# Altium schematic sheet 08_BB_Processor.SchDoc: BB Processor (part 3 of 3)
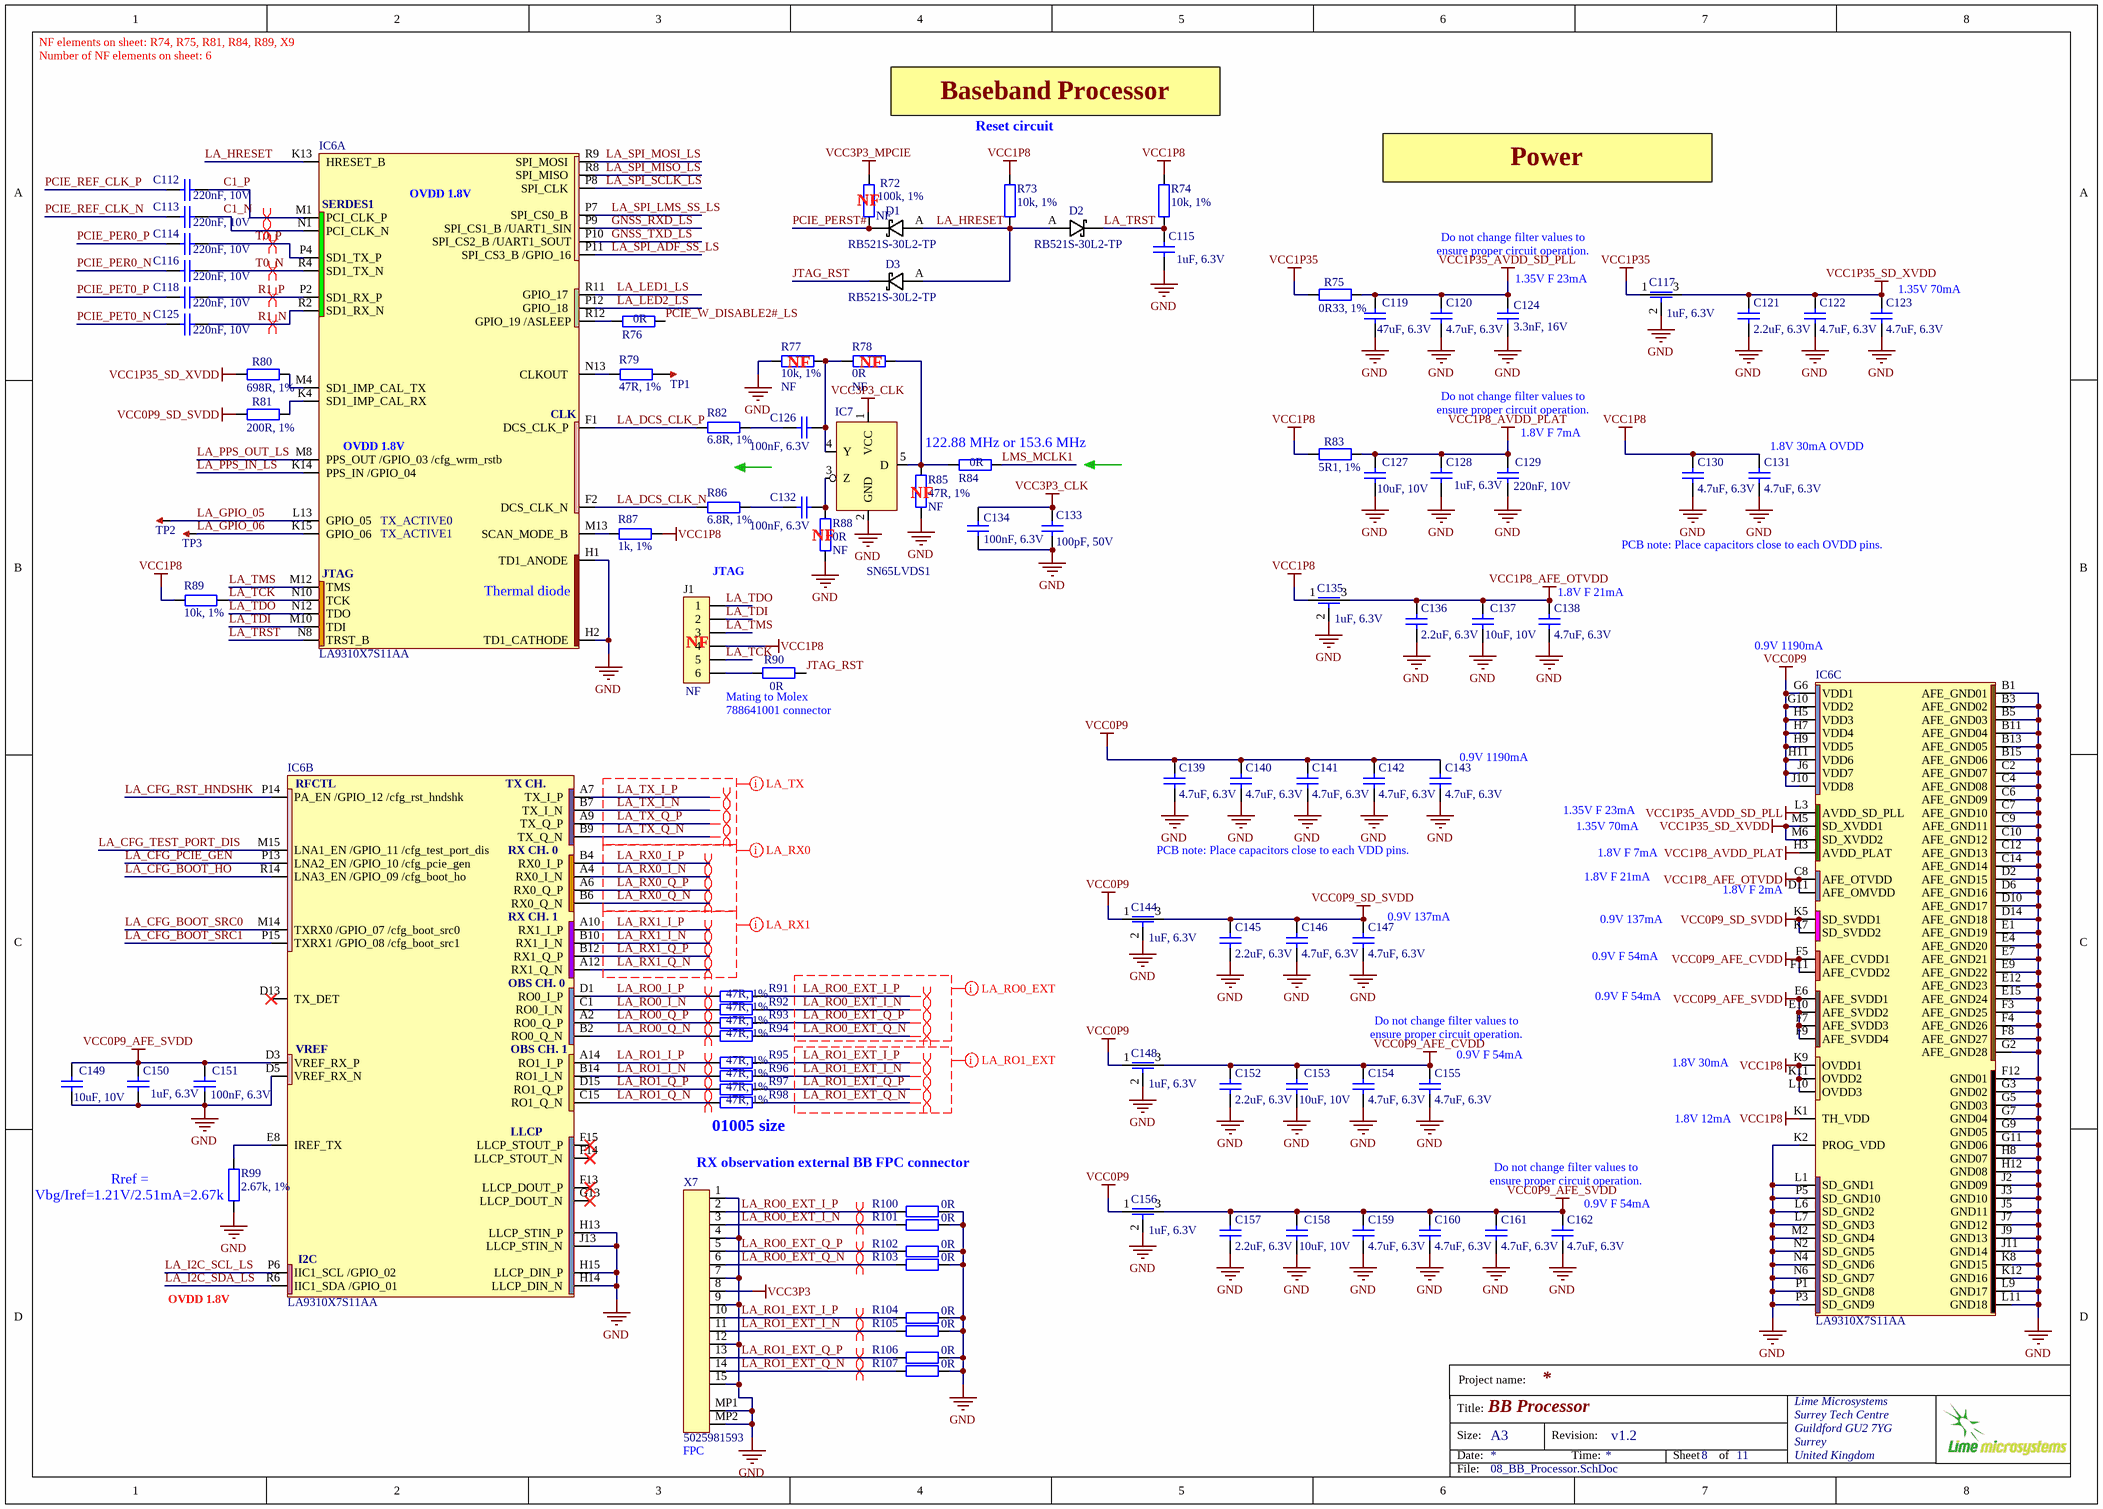
[diagram p2: 08_BB_Processor.SchDoc]

## Library data of the parts (continued)
R100-R107 = Res_0402: Part Description: RES SMD 0 OHM JUMP 1/32W 01005; Manufacturer: Panasonic; Manufacturer Part Number 1: ERJ-XGN0R00Y; Voltage Rating: 15V; Power Rating: 31.25mW; Tolerance: 5%; Temperature Coefficient: -100ppm/°C; Max Power Dissipation: 30mW; Resistance Tolerance: 1%; ComponentLink1URL: http://www.yageo.com/documents/recent/PYu-RC_Group_51_RoHS_L_7.pdf; ComponentLink1Description: http://www.yageo.com/documents/recent/PYu-RC_Group_51_RoHS_L_7.pdf; ComponentLink2URL: https://datasheet.ciiva.com/7672/1563626-7672248.pdf?src-supplier=Element14; ComponentLink2Description: https://datasheet.ciiva.com/7672/1563626-7672248.pdf?src-supplier=Element14; ComponentLink3URL: https://datasheet.ciiva.com/7672/1563626-7672247.pdf?src-supplier=Element14; ComponentLink3Description: https://datasheet.ciiva.com/7672/1563626-7672247.pdf?src-supplier=Element14; ComponentLink4URL: https://datasheet.ciiva.com/7660/1421516-7660808.pdf?src-supplier=Element14; ComponentLink4Description: https://datasheet.ciiva.com/7660/1421516-7660808.pdf?src-supplier=Element14; ComponentLink5URL: https://datasheet.ciiva.com/46391/1421516-46391340.pdf?src-supplier=Element14; ComponentLink5Description: https://datasheet.ciiva.com/46391/1421516-46391340.pdf?src-supplier=Element14; Supplier 1: Digi-Key; Supplier Part Number 1: P0.0AWCT-ND; Stock 1: 2498826; Pricing 1: 1=0,16, 10=0,13, 25=0,0992, 50=0,072, 100=0,0507, 250=0,041, 500=0,0323, 1000=0,02236, 5000=0,01863 (USD); RoHS: Yes; Mount: Surface Mount; Case/Package: Molded; Number of Pins: 2; Case Code (Metric): 0402; Case Code (Imperial): 1005; Contact Plating: Tin; Min Operating Temperature: -55°C; Max Operating Temperature: 125°C; Resistance: 0R; Packaging: Tape and Reel; Package Quantity: 1; Termination: SMD/SMT; Resistor Type: Thick Film; Number of Terminations: 2; Series: ERJ; Construction: Rectangular; Voltage Rating (DC): 15V; Length: 0.4mm; Width: 0.2mm; Height: 0.006inch; Depth: 0.2mm; Radiation Hardening: No; Military Standard: Not; RoHS Compliant: Yes; Reach SVHC Compliant: Unknown; ComponentLink6URL: https://datasheet.ciiva.com/5959/aoa0000ce2-5959897.pdf?src-supplier=Farnell; ComponentLink6Description: https://datasheet.ciiva.com/5959/aoa0000ce2-5959897.pdf?src-supplier=Farnell; ComponentLink7URL: https://datasheet.ciiva.com/7753/1678782-7753973.pdf?src-supplier=Element14; ComponentLink7Description: https://datasheet.ciiva.com/7753/1678782-7753973.pdf?src-supplier=Element14; ComponentLink8URL: https://datasheet.ciiva.com/22765/1678782-22765015.pdf?src-supplier=Farnell; ComponentLink8Description: https://datasheet.ciiva.com/22765/1678782-22765015.pdf?src-supplier=Farnell; ComponentLink9URL: https://datasheet.ciiva.com/22667/1678782-22667862.pdf?src-supplier=Element14; ComponentLink9Description: https://datasheet.ciiva.com/22667/1678782-22667862.pdf?src-supplier=Element14; ComponentLink10URL: https://datasheet.ciiva.com/24055/aoa0000ce1-37422-24055061.pdf?src-supplier=Mouser; ComponentLink10Description: https://datasheet.ciiva.com/24055/aoa0000ce1-37422-24055061.pdf?src-supplier=Mouser; ComponentLink11URL: https://datasheet.ciiva.com/9199/aoa0000ce1-9199022.pdf?src-supplier=Avnet; ComponentLink11Description: https://datasheet.ciiva.com/9199/aoa0000ce1-9199022.pdf?src-supplier=Avnet; ComponentLink12URL: https://datasheet.ciiva.com/30177/4aoa0000ce1-30177151.pdf?src-supplier=Onlinecomponents.com; ComponentLink12Description: https://datasheet.ciiva.com/30177/4aoa0000ce1-30177151.pdf?src-supplier=Onlinecomponents.com; ComponentLink13URL: https://datasheet.ciiva.com/29928/aoa0000ce1-29928300.pdf?src-supplier=Avnet; ComponentLink13Description: https://datasheet.ciiva.com/29928/aoa0000ce1-29928300.pdf?src-supplier=Avnet; Value: 0R
TP1-TP3 = TESTPOINT_PAD: Test Point PCB mount Miniature White
X7 = 5025981593_FPC_connector: Part Description: 15 Position FPC Connector Contacts, Top and Bottom 0.012" (0.30mm) Surface Mount, Right Angle; Manufacturer: Molex; Supplier 1: Digi-Key; Supplier Part Number 1: 900-5025981593CT-ND; Manufacturer Part Number 1: 5025981593; Stock 1: 19758; Pricing 1: 1=1,40000, 10=1,15900, 100=0,96600, 1000=0,77280 (USD); RoHS: Yes